# Altium schematic sheet STM32 + RF + USB.SchDoc
size A3; SheetNumber: 1; SheetTotal: 1
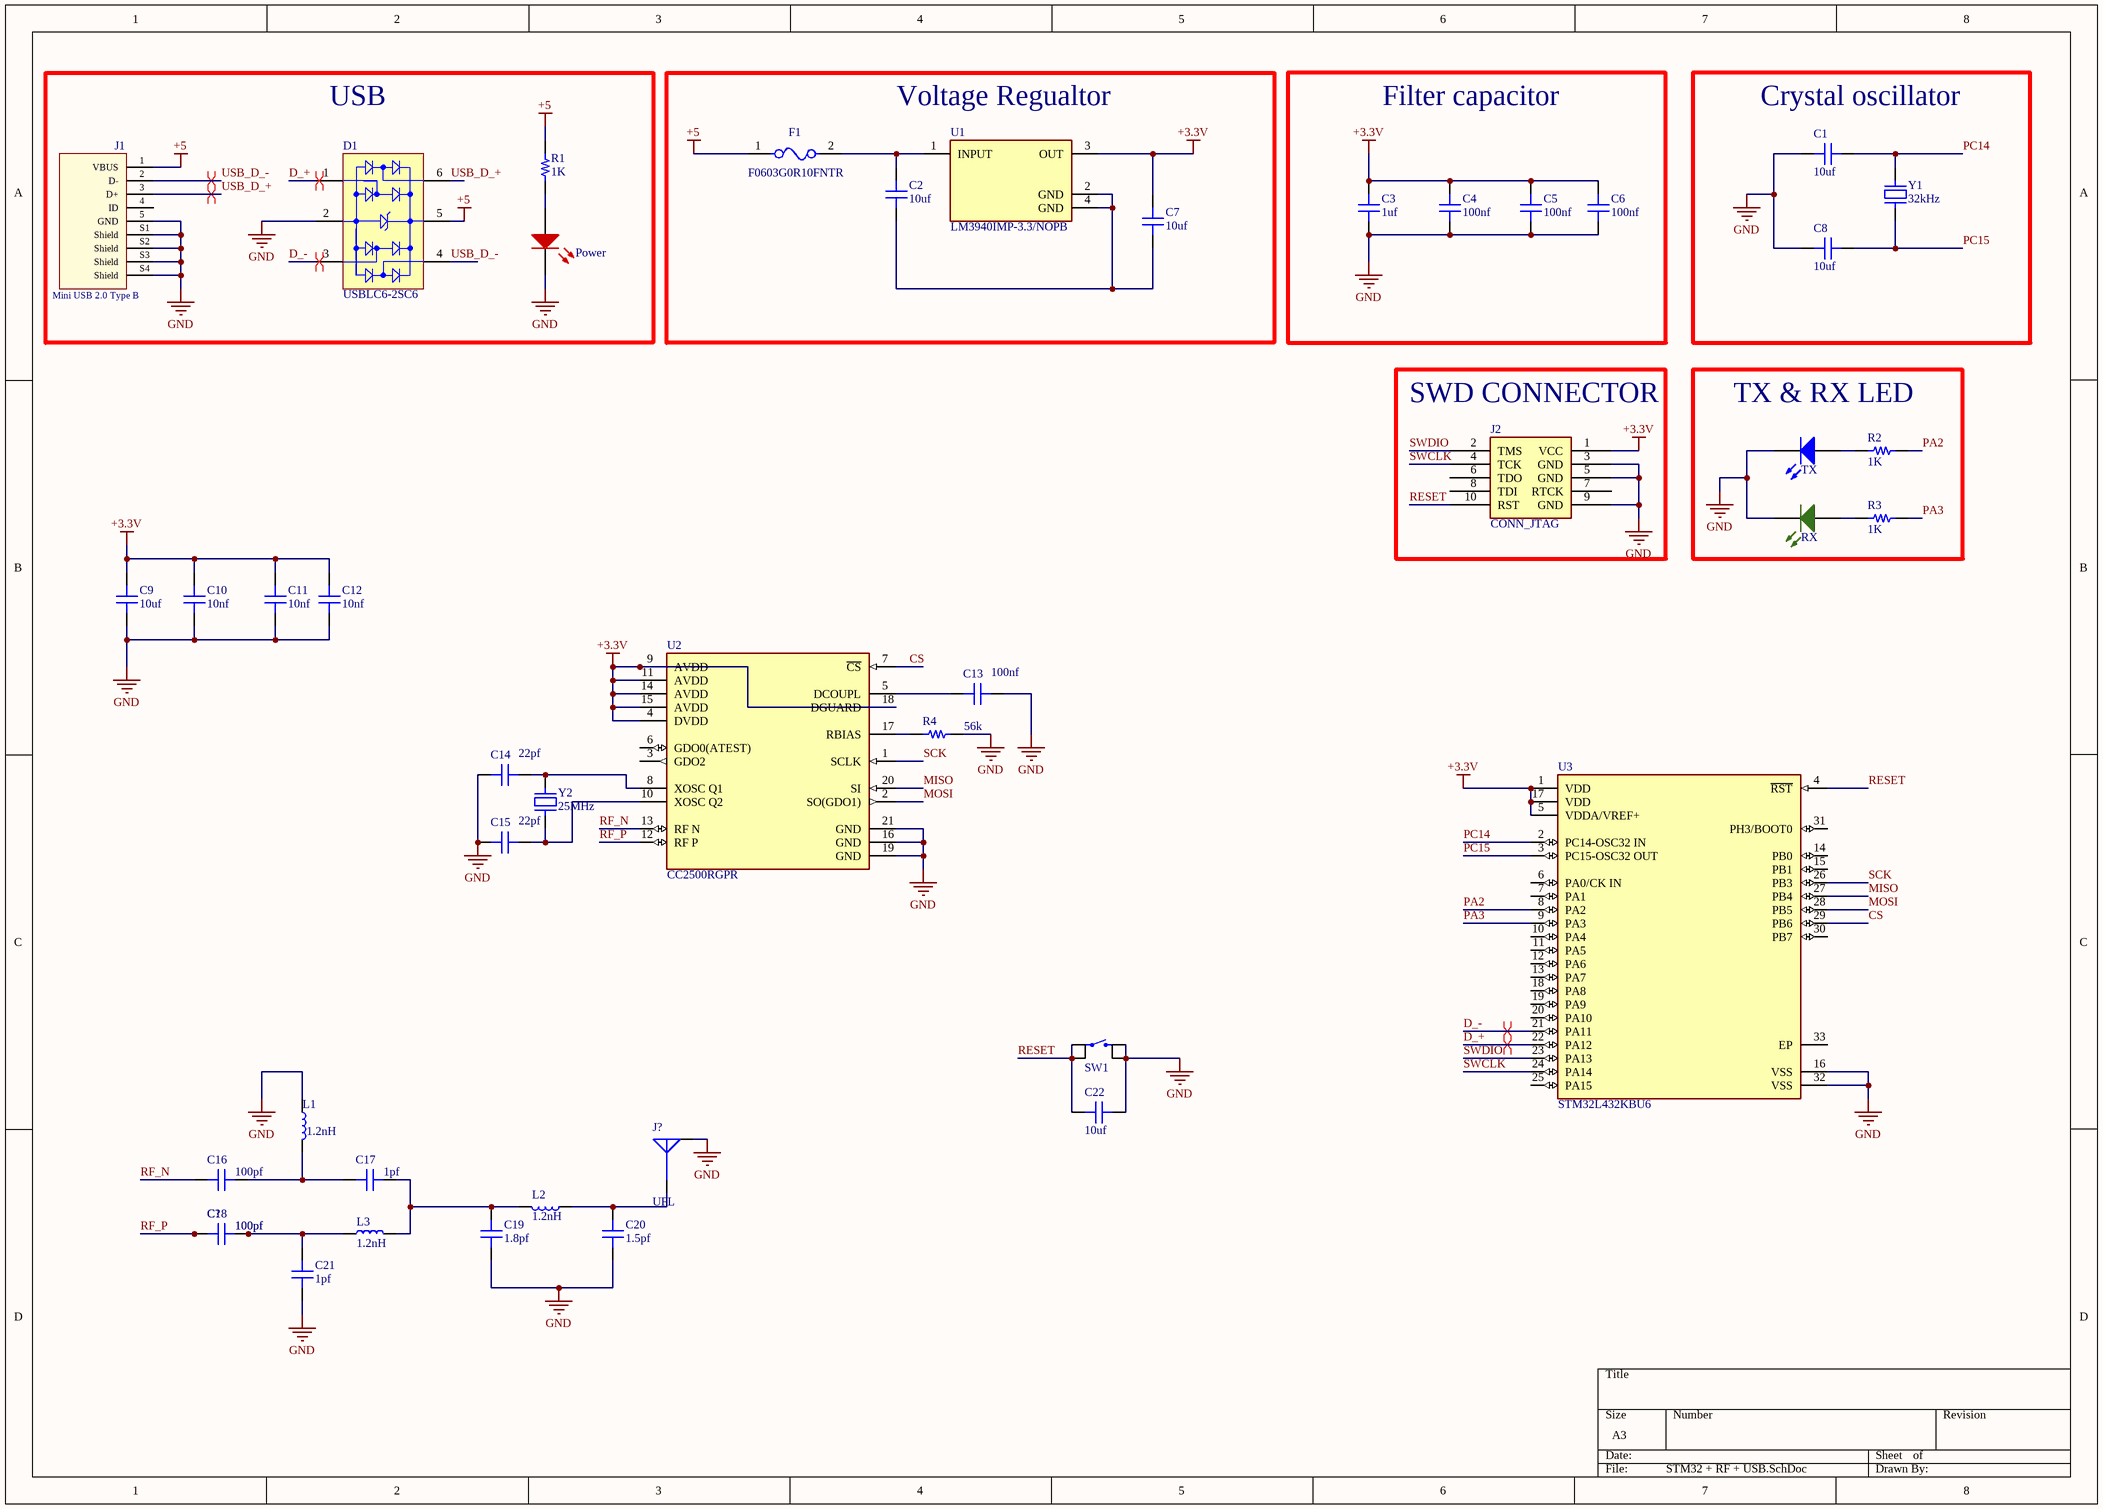
[diagram p0: STM32 + RF + USB.SchDoc]

## Parts
C1  10uf  [CAP 0402_1005]
C2  10uf  [CAP 0402_1005]
C3  1uf  [CAP 0402_1005]
C4  100nf  [CAP 0402_1005]
C5  100nf  [CAP 0402_1005]
C6  100nf  [CAP 0402_1005]
C7  10uf  [CAP 0402_1005]
C8  10uf  [CAP 0402_1005]
C9  10uf  [CAP 0402_1005]
C10  10nf  [CAP 0402_1005]
C11  10nf  [CAP 0402_1005]
C12  10nf  [CAP 0402_1005]
C13  100nf  [CAP 0402_1005]
C14  22pf  [CAP 0402_1005]
C15  22pf  [CAP 0402_1005]
C16  100pf  [CAP 0402_1005]
C17  1pf  [CAP 0402_1005]
C18  100pf  [CAP 0402_1005]
C19  1.8pf  [CAP 0402_1005]
C20  1.5pf  [CAP 0402_1005]
C21  1pf  [CAP 0402_1005]
C22  10uf  [CAP 0603_1608]
C?  100pf  [CAP 0402_1005]
D1  USBLC6-2SC6  [STM-SOT23-6L_V]
F1  F0603G0R10FNTR  [FP-F0603G-MFG]
J1  Mini USB 2.0 Type B  [65100516121]
J2  CONN_JTAG  [IDC_2X5]
J?  UFL  [MOLEX SD-734120110]
L1  1.2nH  [IND 0402_1005]
L2  1.2nH  [IND 0402_1005]
L3  1.2nH  [IND 0402_1005]
Power  LED SMD 0603 RED  [LED_0603_BLUE]  (value not drawn)
R1  1K  [RES 0402_1005]
R2  1K  [RES 0402_1005]
R3  1K  [RES 0402_1005]
R4  56k  [RES 0402_1005]
RX  LED SMD 0603 GREEN  [LED_0603_GREEN]  (value not drawn)
SW1  Tactile 4PIN 6X6mm H4.5mm (SMD)  [SWPBS_SPDT_6X6X5]  (value not drawn)
TX  LED SMD 0603 BLUE  [LED_0603_RED]  (value not drawn)
U1  LM3940IMP-3.3/NOPB  [FP-DCY0004A-MFG]
U2  CC2500RGPR  [FP-RGP0020C-MFG]
U3  STM32L432KBU6  [FP-UFQFPN32-A0B8-MFG]
Y1  32kHz  [HC-49S THT]
Y2  25MHz  [HC-49S SMD]

## Blocks framed on the sheet
USB: D1 J1 Power R1
Voltage Regualtor: C2 C7 F1 U1
Filter capacitor: C3-C6
Crystal oscillator: C1 C8 Y1
SWD CONNECTOR: J2
TX & RX LED: R2 R3 RX TX

## Nets
+3.3V: C3.2 C4.2 C5.2 C6.2 C7.2 C9.2 C10.2 C11.2 C12.2 J2.1(VCC) U1.3(OUT) U2.4(DVDD) U2.9(AVDD) U2.11(AVDD) U2.14(AVDD) U2.15(AVDD) U2.18(DGUARD) U3.1(VDD) U3.5(VDDA/VREF+) U3.17(VDD)
+5: D1.5(VBUS) F1.1 J1.1(VBUS) R1.2
GND: C1.2 C3.1 C4.1 C5.1 C6.1 C8.2 C9.1 C10.1 C11.1 C12.1 C13.1 C14.2 C15.2 C19.2 C20.2 C21.2 C22.2 D1.2(GND) J1.5(GND) J1.S1(Shield) J1.S2(Shield) J1.S3(Shield) J1.S4(Shield) J2.3(GND) J2.5(GND) J2.9(GND) J?.G L1.1 Power.2(K) R4.2 RX.2(K) SW1.2 SW1.3 TX.2(K) U2.16(GND) U2.19(GND) U2.21(GND) U3.16(VSS) U3.32(VSS)
CS: U2.7(~{CS}) U3.29(PB6)
D_+: D1.1(I/O_1) U3.22(PA12)
D_-: D1.3(I/O_2) U3.21(PA11)
MISO: U2.20(SI) U3.27(PB4)
MOSI: U2.2(SO(GDO1)) U3.28(PB5)
PA2: R2.2 U3.8(PA2)
PA3: R3.2 U3.9(PA3)
PC14: C1.1 U3.2(PC14-OSC32_IN) Y1.2
PC15: C8.1 U3.3(PC15-OSC32_OUT) Y1.1
RESET: C22.1 J2.10(RST) SW1.1 SW1.4 U3.4(~{RST})
RF_N: C16.2 U2.13(RF_N)
RF_P: C18.2 C?.2 U2.12(RF_P)
SCK: U2.1(SCLK) U3.26(PB3)
SWCLK: J2.4(TCK) U3.24(PA14)
SWDIO: J2.2(TMS) U3.23(PA13)
USB_D_+: D1.6(I/O_4) J1.3(D+)
USB_D_-: D1.4(I/O_3) J1.2(D-)
NetC2_1: C2.1 C7.1 U1.2(GND) U1.4(GND)
NetC2_2: C2.2 F1.2 U1.1(INPUT)
NetC13_2: C13.2 U2.5(DCOUPL)
NetC14_1: C14.1 U2.8(XOSC_Q1) Y2.2
NetC15_1: C15.1 U2.10(XOSC_Q2) Y2.1
NetC16_1: C16.1 C17.2 L1.2
NetC17_1: C17.1 C19.1 L2.2 L3.2
NetC18_1: C18.1 C21.1 C?.1 L3.1
NetC20_1: C20.1 J?.S L2.1
NetPower_1: Power.1(A) R1.1
NetR2_1: R2.1 TX.1(A)
NetR3_1: R3.1 RX.1(A)
NetR4_1: R4.1 U2.17(RBIAS)

Not connected (* = marked no-connect by the designer): J1 4(ID); J2 6(TDO) 7(RTCK) 8(TDI); U2 3(GDO2) 6(GDO0(ATEST)); U3 6(PA0/CK_IN) 7(PA1) 10(PA4) 11(PA5) 12(PA6) 13(PA7) 14(PB0) 15(PB1) 18(PA8) 19(PA9) 20(PA10) 25(PA15) 30(PB7) 31(PH3/BOOT0) 33(EP)

## Layout directives
differential pair; differential pair class diff90; net class diff90: D_+, D_-, USB_D_+, USB_D_-

## Library data of the parts
C1-C3 C7-C12 C14-C21 C? = Cap 0402: SMT Capacitor; VALUE: 100nF
C4-C6 C13 = Cap 0402: SMT Capacitor; VALUE: 100nF
C22 = Cap 0603: SMT Capacitor; VALUE: 100nF
D1 = CMP-2000-05378-1: Very low capacitance ESD protection, 3.5 pF, -40 to 125 degC, 6-Pin SOT23, RoHS, Tape and Reel; Manufacturer: STMicroelectronics; Polarity: Uni-Directional; Clamping Voltage: 17V; Rad Hardened: No; Product Height (mm): 1.3mm; Leakage Current (Max): 0.15uA; Product Length (mm): 3.05mm; Number of Elements: 1; Peak Pulse Current: 5A; Configuration: Dual; Reverse Breakdown Voltage: 6V; Working Voltage (Max): 5V; Capacitance Value: 3.5pF; Suppressor Type: DiodeArrays; Product Depth (mm): 1.75mm; Test Current (It): 1mA; Package / Case: SOT-23; Operating Temperature Max Deg. C: 125C; Package Description: 6-Pin Small Outline Transistor, Body 2.925 x 1.625 mm, Pitch 0.95 mm; Package Reference: SOT23-6L; Datasheet Version: Rev. 5, 10/2011; Operating Temperature Min Deg. C: -40C; Mounting Style: SurfaceMount; Direction Type: Uni-Directional; Mounting: SurfaceMount; Pin Count: 6; Leakage Current: 0.15uA; Packaging: TapeandReel; Operating Temperature Classification: Automotive; Clamping Voltage (Max): 17V; Manufacturer URL: http://www.st.com/; Reverse Stand-off Voltage: 5V; Datasheet URL: http://www.st.com/st-web-ui/static/active/en/resource/technical/document/datasheet/CD00050750.pdf; Working Voltage: 5V; Operating Temp Range: -40Cto125C
F1 = CMP-04585-000001-1: FUSE BOARD MNT 100MA 32VDC 0603; Manufacturer: AVX Corporation; Fuse Voltage Drop: 300mV; Voltage Rating: 63V; Fuse I2T: 0.000007A2Sec; Value: 2.4Ω; Fuse Current: 0.1A; Fuse Blow Speed: Fast; RoHS: TRUE; Manufacturer Part Number: F0603G0R10FNTR; Ipc Land Pattern Name: CAPC16081X61; Automotive: No; ComponentLink2URL: http://datasheets.avx.com/AccuGuardLC_0402.pdf; Package: F0603G; Category: Fuse; Height: 0.71mm; Device Class L2: Fuses; Octopart: https://octopart.com/f0603g0r10fntr-avx-21046322; Lead Free: Yes; Mouser Description: Fuse Chip Fast Acting 0.1A 32V SMD Solder Pad 1.6 x 0.8 mm T/R; Temperature: -55°C to +125°C; Temperature Range Low: -55°C; Device Class L1: Circuit Protection; Resistance: 2.4Ω; Device Class L3: unset; ComponentLink2Description: Datasheet; Temperature Range High: +125°C; Digikey Description: FUSE BOARD MNT 100MA 32VDC 0603
J1 = Mini USB 2.0 Type B Horizontal (SMD) 65100516121: Mini USB 2.0 Type B Horizontal SMT 5 Contacts WR-COM; Rated Current: 1 A; Gender: Female; ComponentLink1Description: Manufacturer; ComponentLink1URL: http://www.we-online.de; ComponentLink2Description: Datasheet; ComponentLink2URL: http://katalog.we-online.de/em/datasheet/65100516121.pdf; PartNumber: 65100516121; Published Date: May 2018; Publisher: Wurth Elektronik; Orientation: Horizontal; Interface Type: Mini USB 2.0 Type B; Operating Temperature: -40 to 105 degC; Mounting Technology: SMT; Packaging: Tray
J2 = JTAG_ARM_10: CONN, JTAG, ARM, 10P; VALUE: CONN_JTAG
J? = UFL MOLEX SD-734120110: PartNumber: MOLEX SD-734120110
L1-L3 = Ind 0402: SMT Inductor; Value: 1.2nH
R1-R3 = Res 0402: SMT Resistor; VALUE: 1K
R4 = Res 0402: SMT Resistor; VALUE: 1K
SW1 = Tactile 4PIN 6X6mm H4.5mm (SMD): Tactile Switch SPST-NO Top Actuated Surface Mount; PartNumber: PTS645SM43SMTR92 LFS
U1 = CMP-0062-01788-4: IC REG LINEAR 3.3V 1A SOT223-4; Min Input Voltage: 4.5V; Max Supply Voltage: 7.5V; Number of Outputs: 1; Output Type: Fixed; Polarity: Positive; Dropout Voltage: 500mV; Quiescent Current: 15mA; Max Output Voltage: 3.3V; Length: 6.5mm; Termination: SMD/SMT; Width: 3.56mm; Min Supply Voltage: 4.5V; Max Output Current: 1A; Case/Package: SOT-223; Output Voltage: 3.3V; Current Rating: 1A; Packaging: Tape and Reel; Lead Free: Lead Free; Nominal Output Voltage: 3.3V; Height: 1.6mm; Series: -; Output Configuration: Positive; Radiation Hardening: No; Number of Regulators: 1; Package Quantity: 1000; REACH SVHC: No SVHC; Max Input Voltage: 7.5V; Max Operating Temperature: 125°C; Min Operating Temperature: -40°C; Output Current: 1A; Contact Plating: Tin; Number of Pins: 4; Mount: Surface Mount
U2 = CMP-04924-000028-1: IC RF TXRX ISM>1GHZ 20VFQFN; Max Frequency: 2.4835GHz; Number of Transmitters: 1; Min Supply Voltage: 1.8V; Max Supply Voltage: 3.6V; Frequency: 2.4GHz; Interface: SPI; Density: 0B; Data Rate: 500Kbps; Current - Transmitting: 21.5mA; Sensitivity: -104dBm; Current - Receiving: 19.6mA; Mount: Surface Mount; REACH SVHC: No SVHC; Package Quantity: 3000; Packaging: Tape and Reel; Contact Plating: Gold; Max Operating Temperature: 85°C; Length: 4.15mm; Depth: 4.15mm; RoHS Compliant: Yes; Lead Free: Lead Free; Min Operating Temperature: -40°C; Number of Pins: 20; Number of Receivers: 1; Case/Package: VQFN
U3 = CMP-12105-000014-1: IC MCU 32BIT 128KB FLASH 32QFPN; Manufacturer: STMicroelectronics; Memory Size: 128KBytes; Number Of I/Os: 26; Max Supply Voltage: 3.6V; Core Architecture: ARM Cortex-M4; Number Of A/D Converters: 1; Number Of Timers/Counters: 8; Min Supply Voltage: 1.62V; Interface: I2C,SPI,UART,USART,USB,IrDA; Number Of Spi Channels: 2; Frequency: 80MHz; Max Junction Temp: +105°C; Number Of Adc Channels: 10; Ram Size: 64KBytes; Data Bus Width: 32bits; Ambient Temperature Range High: +85°C; Device Class L2: Embedded Processors and Controllers; Temperature: -40°C to +85°C; Category: IC; ComponentLink2URL: https://www.st.com/resource/en/datasheet/stm32l432kb.pdf; Device Class L1: Integrated Circuits (ICs); ComponentLink2Description: Datasheet; Memory Type: FLASH; Ipc Land Pattern Name: QFN50P500X500X55-32; Temperature Range Low: -40°C; Height: 0.6mm; Digikey Description: IC MCU 32BIT 128KB FLASH 32QFPN; Temperature Range High: +85°C; Device Class L3: Microcontrollers; Lead Free: Yes; RoHS: TRUE; Octopart: https://octopart.com/stm32l432kbu6-stmicroelectronics-74568735; Manufacturer Part Number: STM32L432KBU6; Number Of Uart Channels: 1; Ambient Temperature Range Low: -40°C; Package: UFQFPN32-A0B8; Number Of I2C Channels: 2; Number Of Cores: 1; Automotive: No
Y1 = Crystal HC-49S THD: THT Crystal; VALUE: 8.0MHZ
Y2 = Crystal HC-49S SMD 25MHz: SMT Crystal; PartNumber: ABLS-25.000MHZ-B2F-T